# Altium schematic sheet Main.SchDoc
size A0 portrait; SheetNumber: 2; SheetTotal: 16
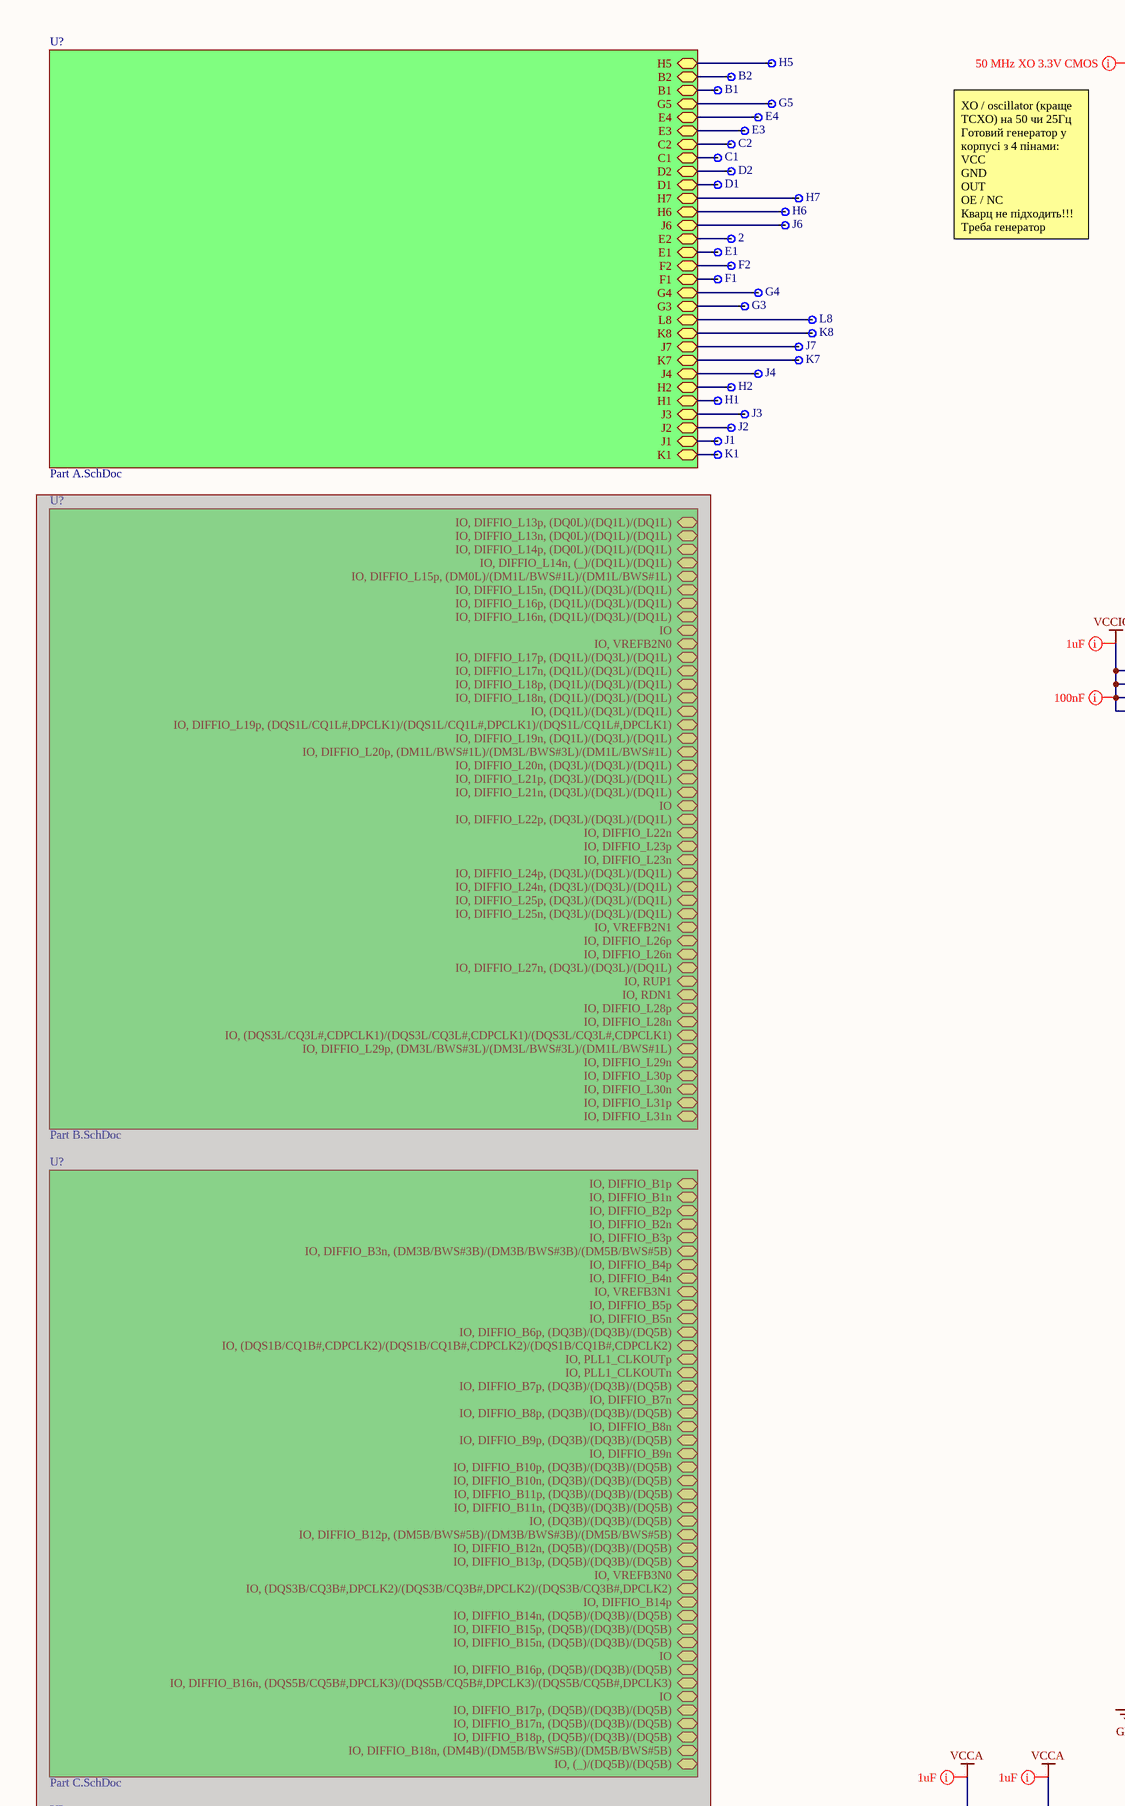
[diagram p0: Main.SchDoc, top left]
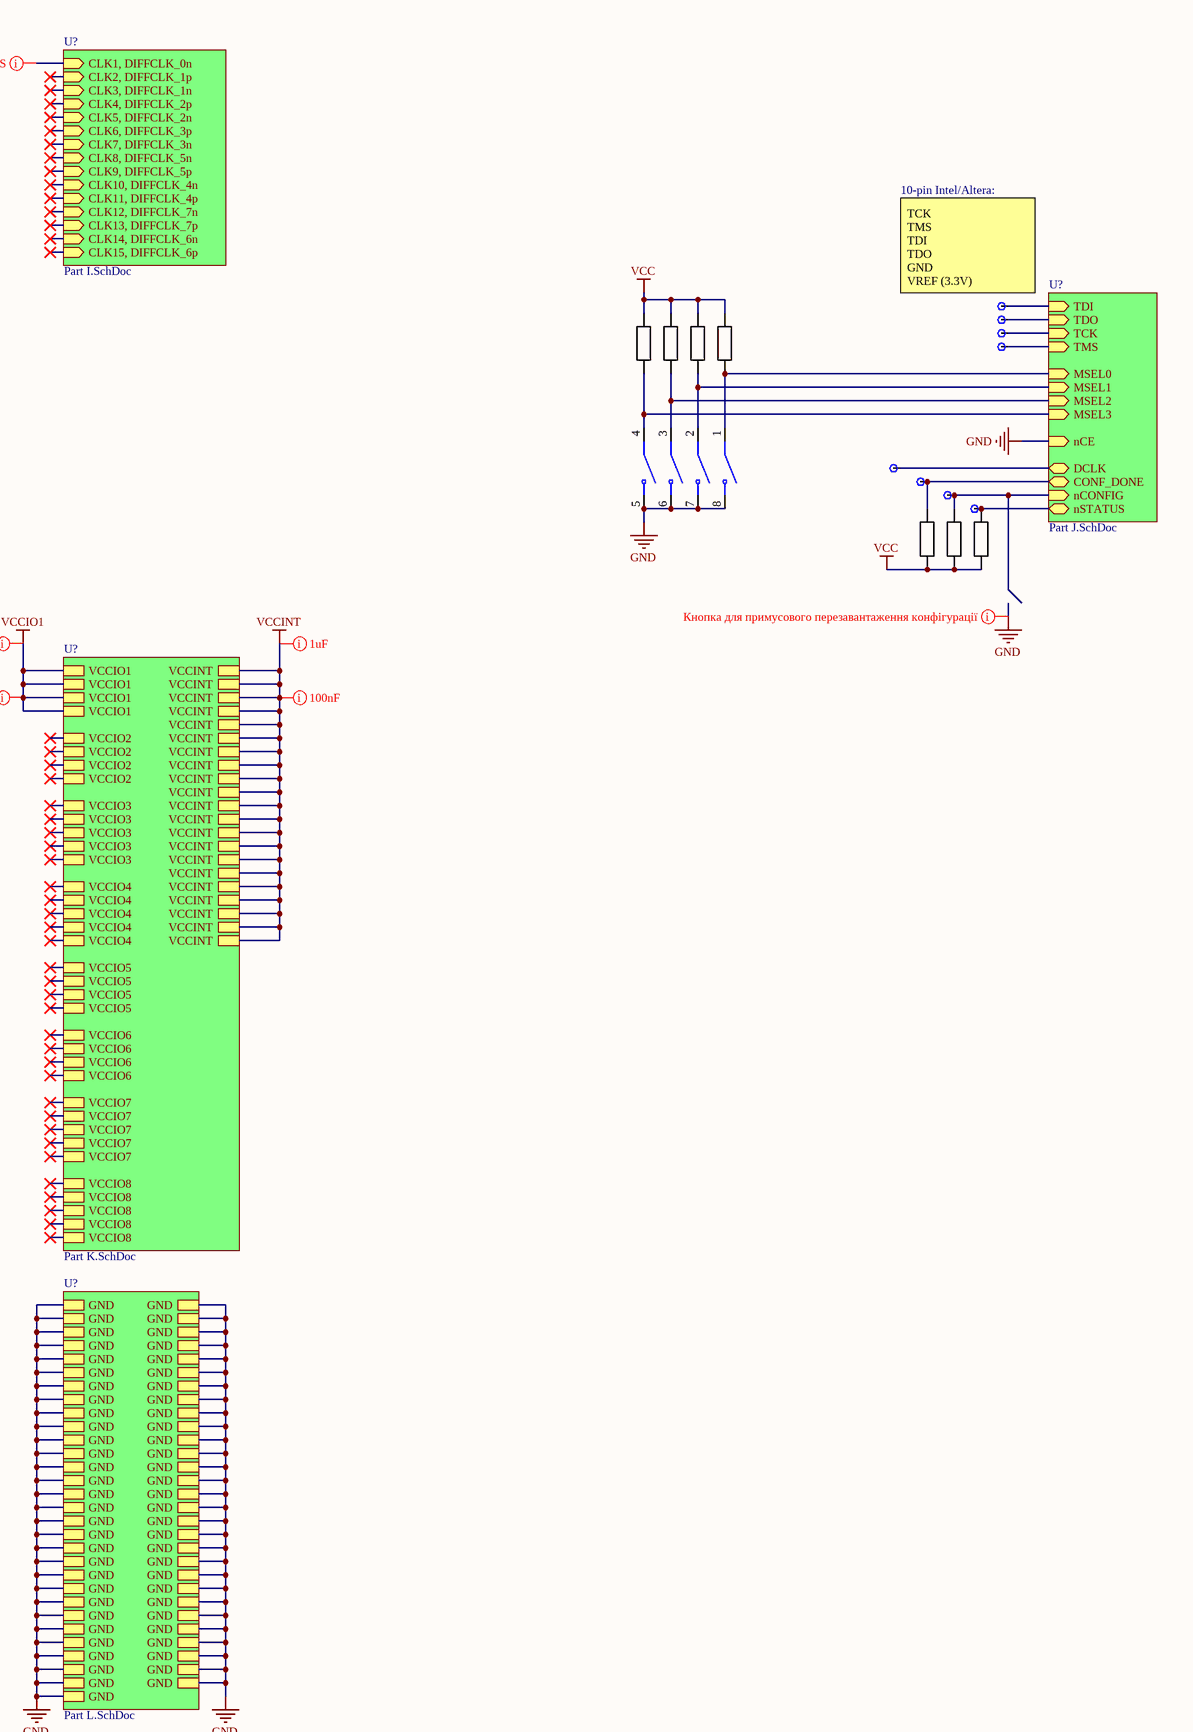
[diagram p1: Main.SchDoc, top right]
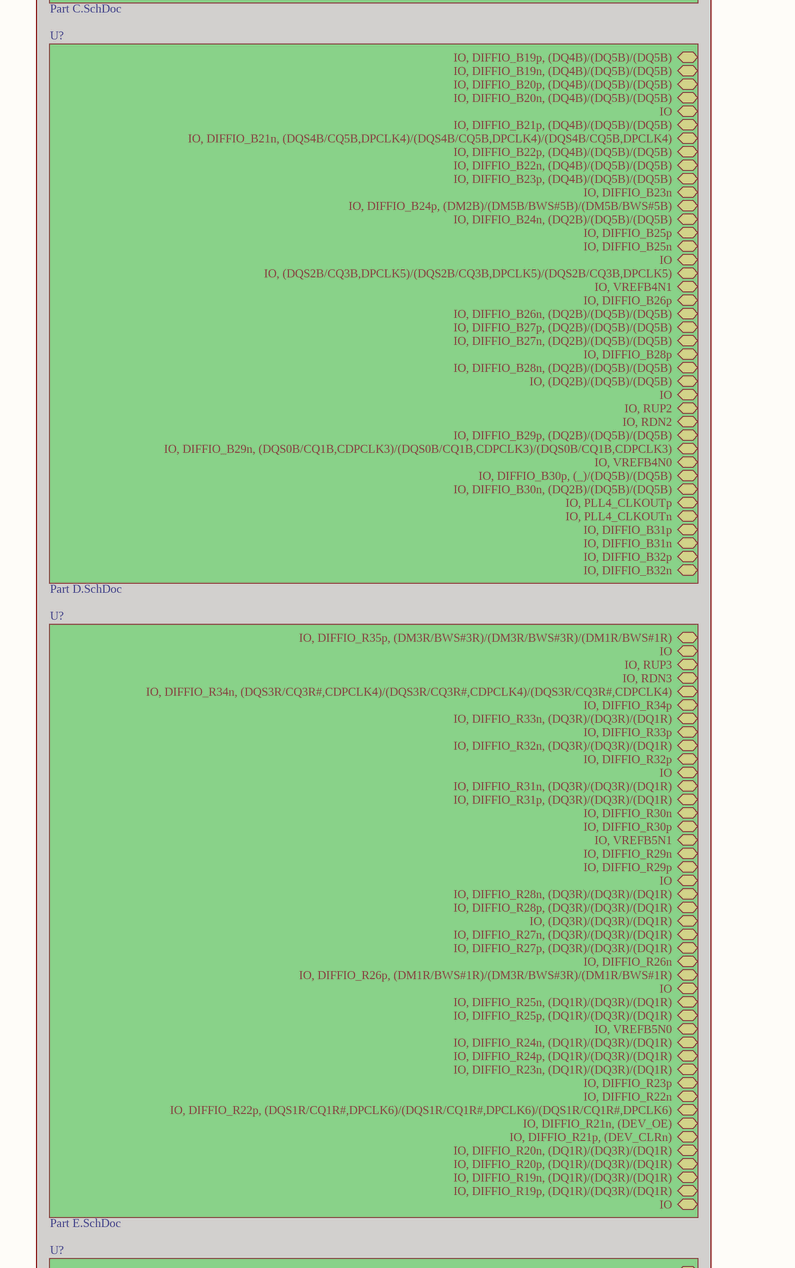
[diagram p2: Main.SchDoc, centre left]
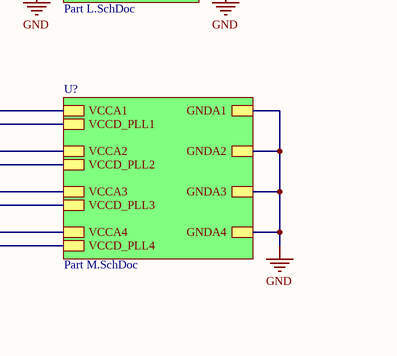
[diagram p3: Main.SchDoc, centre right]
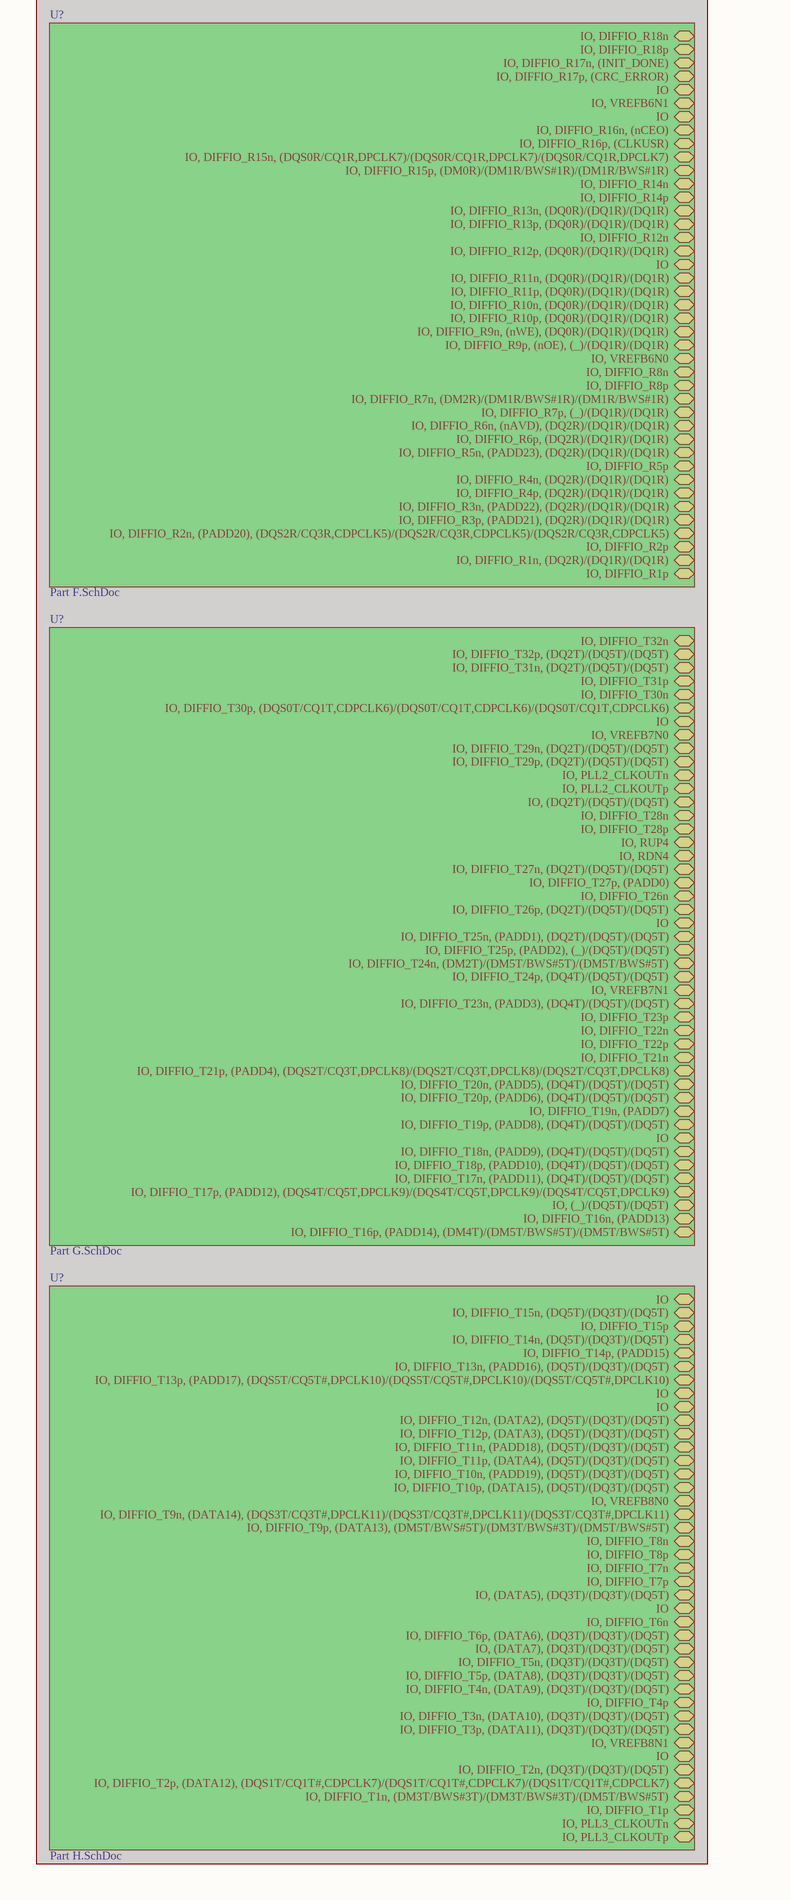
[diagram p4: Main.SchDoc, bottom left]

## Parts
J161  H5  [Pin1]
J162  B2  [Pin1]
J163  B1  [Pin1]
J164  G5  [Pin1]
J165  E4  [Pin1]
J166  E3  [Pin1]
J167  C2  [Pin1]
J168  C1  [Pin1]
J169  D2  [Pin1]
J170  D1  [Pin1]
J171  H7  [Pin1]
J172  H6  [Pin1]
J173  J6  [Pin1]
J174  2  [Pin1]
J175  E1  [Pin1]
J176  F2  [Pin1]
J177  F1  [Pin1]
J178  G4  [Pin1]
J179  G3  [Pin1]
J180  Pin1  [Pin1]  (value not drawn)
J181  L8  [Pin1]
J182  Pin1  [Pin1]  (value not drawn)
J183  K8  [Pin1]
J184  Pin1  [Pin1]  (value not drawn)
J185  J7  [Pin1]
J186  Pin1  [Pin1]  (value not drawn)
J187  K7  [Pin1]
J188  J4  [Pin1]
J189  H2  [Pin1]
J190  H1  [Pin1]
J191  J3  [Pin1]
J192  J2  [Pin1]
J193  J1  [Pin1]
J194  K1  [Pin1]
J195  Pin1  [Pin1]  (value not drawn)
J196  Pin1  [Pin1]  (value not drawn)
J197  Pin1  [Pin1]  (value not drawn)
J198  Pin1  [Pin1]  (value not drawn)
R1  10kOm 0603  [RES 0603]  (value not drawn)
R2  10kOm 0603  [RES 0603]  (value not drawn)
R3  10kOm 0603  [RES 0603]  (value not drawn)
R4  10kOm 0603  [RES 0603]  (value not drawn)
R5  10kOm 0603  [RES 0603]  (value not drawn)
R6  10kOm 0603  [RES 0603]  (value not drawn)
R7  10kOm 0603  [RES 0603]  (value not drawn)
S1  206-4  [SW_206-4]  (value not drawn)

## Sub-sheets
U? = Part A.SchDoc: H5 (bidir), B2 (bidir), B1 (bidir), G5 (bidir), E4 (bidir), E3 (bidir), C2 (bidir), C1 (bidir), D2 (bidir), D1 (bidir), H7 (bidir), H6 (bidir), J6 (bidir), E2 (bidir), E1 (bidir), F2 (bidir), F1 (bidir), G4 (bidir), G3 (bidir), L8 (bidir), K8 (bidir), J7 (bidir), K7 (bidir), J4 (bidir), H2 (bidir), H1 (bidir), J3 (bidir), J2 (bidir), J1 (bidir), K1 (bidir)
U? = Part B.SchDoc (masked out): IO, DIFFIO_L13p, (DQ0L)/(DQ1L)/(DQ1L) (bidir), IO, DIFFIO_L13n, (DQ0L)/(DQ1L)/(DQ1L) (bidir), IO, DIFFIO_L14p, (DQ0L)/(DQ1L)/(DQ1L) (bidir), IO, DIFFIO_L14n, (_)/(DQ1L)/(DQ1L) (bidir), IO, DIFFIO_L15p, (DM0L)/(DM1L/BWS#1L)/(DM1L/BWS#1L) (bidir), IO, DIFFIO_L15n, (DQ1L)/(DQ3L)/(DQ1L) (bidir), IO, DIFFIO_L16p, (DQ1L)/(DQ3L)/(DQ1L) (bidir), IO, DIFFIO_L16n, (DQ1L)/(DQ3L)/(DQ1L) (bidir), IO (bidir), IO, VREFB2N0 (bidir), IO, DIFFIO_L17p, (DQ1L)/(DQ3L)/(DQ1L) (bidir), IO, DIFFIO_L17n, (DQ1L)/(DQ3L)/(DQ1L) (bidir), IO, DIFFIO_L18p, (DQ1L)/(DQ3L)/(DQ1L) (bidir), IO, DIFFIO_L18n, (DQ1L)/(DQ3L)/(DQ1L) (bidir), IO, (DQ1L)/(DQ3L)/(DQ1L) (bidir), IO, DIFFIO_L19p, (DQS1L/CQ1L#,DPCLK1)/(DQS1L/CQ1L#,DPCLK1)/(DQS1L/CQ1L#,DPCLK1) (bidir), IO, DIFFIO_L19n, (DQ1L)/(DQ3L)/(DQ1L) (bidir), IO, DIFFIO_L20p, (DM1L/BWS#1L)/(DM3L/BWS#3L)/(DM1L/BWS#1L) (bidir), IO, DIFFIO_L20n, (DQ3L)/(DQ3L)/(DQ1L) (bidir), IO, DIFFIO_L21p, (DQ3L)/(DQ3L)/(DQ1L) (bidir), IO, DIFFIO_L21n, (DQ3L)/(DQ3L)/(DQ1L) (bidir), IO (bidir), IO, DIFFIO_L22p, (DQ3L)/(DQ3L)/(DQ1L) (bidir), IO, DIFFIO_L22n (bidir), IO, DIFFIO_L23p (bidir), IO, DIFFIO_L23n (bidir), IO, DIFFIO_L24p, (DQ3L)/(DQ3L)/(DQ1L) (bidir), IO, DIFFIO_L24n, (DQ3L)/(DQ3L)/(DQ1L) (bidir), IO, DIFFIO_L25p, (DQ3L)/(DQ3L)/(DQ1L) (bidir), IO, DIFFIO_L25n, (DQ3L)/(DQ3L)/(DQ1L) (bidir), IO, VREFB2N1 (bidir), IO, DIFFIO_L26p (bidir), IO, DIFFIO_L26n (bidir), IO, DIFFIO_L27n, (DQ3L)/(DQ3L)/(DQ1L) (bidir), IO, RUP1 (bidir), IO, RDN1 (bidir), IO, DIFFIO_L28p (bidir), IO, DIFFIO_L28n (bidir), IO, (DQS3L/CQ3L#,CDPCLK1)/(DQS3L/CQ3L#,CDPCLK1)/(DQS3L/CQ3L#,CDPCLK1) (bidir), IO, DIFFIO_L29p, (DM3L/BWS#3L)/(DM3L/BWS#3L)/(DM1L/BWS#1L) (bidir), IO, DIFFIO_L29n (bidir), IO, DIFFIO_L30p (bidir), IO, DIFFIO_L30n (bidir), IO, DIFFIO_L31p (bidir), IO, DIFFIO_L31n (bidir)
U? = Part C.SchDoc (masked out): IO, DIFFIO_B1p (bidir), IO, DIFFIO_B1n (bidir), IO, DIFFIO_B2p (bidir), IO, DIFFIO_B2n (bidir), IO, DIFFIO_B3p (bidir), IO, DIFFIO_B3n, (DM3B/BWS#3B)/(DM3B/BWS#3B)/(DM5B/BWS#5B) (bidir), IO, DIFFIO_B4p (bidir), IO, DIFFIO_B4n (bidir), IO, VREFB3N1 (bidir), IO, DIFFIO_B5p (bidir), IO, DIFFIO_B5n (bidir), IO, DIFFIO_B6p, (DQ3B)/(DQ3B)/(DQ5B) (bidir), IO, (DQS1B/CQ1B#,CDPCLK2)/(DQS1B/CQ1B#,CDPCLK2)/(DQS1B/CQ1B#,CDPCLK2) (bidir), IO, PLL1_CLKOUTp (bidir), IO, PLL1_CLKOUTn (bidir), IO, DIFFIO_B7p, (DQ3B)/(DQ3B)/(DQ5B) (bidir), IO, DIFFIO_B7n (bidir), IO, DIFFIO_B8p, (DQ3B)/(DQ3B)/(DQ5B) (bidir), IO, DIFFIO_B8n (bidir), IO, DIFFIO_B9p, (DQ3B)/(DQ3B)/(DQ5B) (bidir), IO, DIFFIO_B9n (bidir), IO, DIFFIO_B10p, (DQ3B)/(DQ3B)/(DQ5B) (bidir), IO, DIFFIO_B10n, (DQ3B)/(DQ3B)/(DQ5B) (bidir), IO, DIFFIO_B11p, (DQ3B)/(DQ3B)/(DQ5B) (bidir), IO, DIFFIO_B11n, (DQ3B)/(DQ3B)/(DQ5B) (bidir), IO, (DQ3B)/(DQ3B)/(DQ5B) (bidir), IO, DIFFIO_B12p, (DM5B/BWS#5B)/(DM3B/BWS#3B)/(DM5B/BWS#5B) (bidir), IO, DIFFIO_B12n, (DQ5B)/(DQ3B)/(DQ5B) (bidir), IO, DIFFIO_B13p, (DQ5B)/(DQ3B)/(DQ5B) (bidir), IO, VREFB3N0 (bidir), IO, (DQS3B/CQ3B#,DPCLK2)/(DQS3B/CQ3B#,DPCLK2)/(DQS3B/CQ3B#,DPCLK2) (bidir), IO, DIFFIO_B14p (bidir), IO, DIFFIO_B14n, (DQ5B)/(DQ3B)/(DQ5B) (bidir), IO, DIFFIO_B15p, (DQ5B)/(DQ3B)/(DQ5B) (bidir), IO, DIFFIO_B15n, (DQ5B)/(DQ3B)/(DQ5B) (bidir), IO (bidir), IO, DIFFIO_B16p, (DQ5B)/(DQ3B)/(DQ5B) (bidir), IO, DIFFIO_B16n, (DQS5B/CQ5B#,DPCLK3)/(DQS5B/CQ5B#,DPCLK3)/(DQS5B/CQ5B#,DPCLK3) (bidir), IO (bidir), IO, DIFFIO_B17p, (DQ5B)/(DQ3B)/(DQ5B) (bidir), IO, DIFFIO_B17n, (DQ5B)/(DQ3B)/(DQ5B) (bidir), IO, DIFFIO_B18p, (DQ5B)/(DQ3B)/(DQ5B) (bidir), IO, DIFFIO_B18n, (DM4B)/(DM5B/BWS#5B)/(DM5B/BWS#5B) (bidir), IO, (_)/(DQ5B)/(DQ5B) (bidir)
U? = Part D.SchDoc (masked out): IO, DIFFIO_B19p, (DQ4B)/(DQ5B)/(DQ5B) (bidir), IO, DIFFIO_B19n, (DQ4B)/(DQ5B)/(DQ5B) (bidir), IO, DIFFIO_B20p, (DQ4B)/(DQ5B)/(DQ5B) (bidir), IO, DIFFIO_B20n, (DQ4B)/(DQ5B)/(DQ5B) (bidir), IO (bidir), IO, DIFFIO_B21p, (DQ4B)/(DQ5B)/(DQ5B) (bidir), IO, DIFFIO_B21n, (DQS4B/CQ5B,DPCLK4)/(DQS4B/CQ5B,DPCLK4)/(DQS4B/CQ5B,DPCLK4) (bidir), IO, DIFFIO_B22p, (DQ4B)/(DQ5B)/(DQ5B) (bidir), IO, DIFFIO_B22n, (DQ4B)/(DQ5B)/(DQ5B) (bidir), IO, DIFFIO_B23p, (DQ4B)/(DQ5B)/(DQ5B) (bidir), IO, DIFFIO_B23n (bidir), IO, DIFFIO_B24p, (DM2B)/(DM5B/BWS#5B)/(DM5B/BWS#5B) (bidir), IO, DIFFIO_B24n, (DQ2B)/(DQ5B)/(DQ5B) (bidir), IO, DIFFIO_B25p (bidir), IO, DIFFIO_B25n (bidir), IO (bidir), IO, (DQS2B/CQ3B,DPCLK5)/(DQS2B/CQ3B,DPCLK5)/(DQS2B/CQ3B,DPCLK5) (bidir), IO, VREFB4N1 (bidir), IO, DIFFIO_B26p (bidir), IO, DIFFIO_B26n, (DQ2B)/(DQ5B)/(DQ5B) (bidir), IO, DIFFIO_B27p, (DQ2B)/(DQ5B)/(DQ5B) (bidir), IO, DIFFIO_B27n, (DQ2B)/(DQ5B)/(DQ5B) (bidir), IO, DIFFIO_B28p (bidir), IO, DIFFIO_B28n, (DQ2B)/(DQ5B)/(DQ5B) (bidir), IO, (DQ2B)/(DQ5B)/(DQ5B) (bidir), IO (bidir), IO, RUP2 (bidir), IO, RDN2 (bidir), IO, DIFFIO_B29p, (DQ2B)/(DQ5B)/(DQ5B) (bidir), IO, DIFFIO_B29n, (DQS0B/CQ1B,CDPCLK3)/(DQS0B/CQ1B,CDPCLK3)/(DQS0B/CQ1B,CDPCLK3) (bidir), IO, VREFB4N0 (bidir), IO, DIFFIO_B30p, (_)/(DQ5B)/(DQ5B) (bidir), IO, DIFFIO_B30n, (DQ2B)/(DQ5B)/(DQ5B) (bidir), IO, PLL4_CLKOUTp (bidir), IO, PLL4_CLKOUTn (bidir), IO, DIFFIO_B31p (bidir), IO, DIFFIO_B31n (bidir), IO, DIFFIO_B32p (bidir), IO, DIFFIO_B32n (bidir)
U? = Part E.SchDoc (masked out): IO, DIFFIO_R35p, (DM3R/BWS#3R)/(DM3R/BWS#3R)/(DM1R/BWS#1R) (bidir), IO (bidir), IO, RUP3 (bidir), IO, RDN3 (bidir), IO, DIFFIO_R34n, (DQS3R/CQ3R#,CDPCLK4)/(DQS3R/CQ3R#,CDPCLK4)/(DQS3R/CQ3R#,CDPCLK4) (bidir), IO, DIFFIO_R34p (bidir), IO, DIFFIO_R33n, (DQ3R)/(DQ3R)/(DQ1R) (bidir), IO, DIFFIO_R33p (bidir), IO, DIFFIO_R32n, (DQ3R)/(DQ3R)/(DQ1R) (bidir), IO, DIFFIO_R32p (bidir), IO (bidir), IO, DIFFIO_R31n, (DQ3R)/(DQ3R)/(DQ1R) (bidir), IO, DIFFIO_R31p, (DQ3R)/(DQ3R)/(DQ1R) (bidir), IO, DIFFIO_R30n (bidir), IO, DIFFIO_R30p (bidir), IO, VREFB5N1 (bidir), IO, DIFFIO_R29n (bidir), IO, DIFFIO_R29p (bidir), IO (bidir), IO, DIFFIO_R28n, (DQ3R)/(DQ3R)/(DQ1R) (bidir), IO, DIFFIO_R28p, (DQ3R)/(DQ3R)/(DQ1R) (bidir), IO, (DQ3R)/(DQ3R)/(DQ1R) (bidir), IO, DIFFIO_R27n, (DQ3R)/(DQ3R)/(DQ1R) (bidir), IO, DIFFIO_R27p, (DQ3R)/(DQ3R)/(DQ1R) (bidir), IO, DIFFIO_R26n (bidir), IO, DIFFIO_R26p, (DM1R/BWS#1R)/(DM3R/BWS#3R)/(DM1R/BWS#1R) (bidir), IO (bidir), IO, DIFFIO_R25n, (DQ1R)/(DQ3R)/(DQ1R) (bidir), IO, DIFFIO_R25p, (DQ1R)/(DQ3R)/(DQ1R) (bidir), IO, VREFB5N0 (bidir), IO, DIFFIO_R24n, (DQ1R)/(DQ3R)/(DQ1R) (bidir), IO, DIFFIO_R24p, (DQ1R)/(DQ3R)/(DQ1R) (bidir), IO, DIFFIO_R23n, (DQ1R)/(DQ3R)/(DQ1R) (bidir), IO, DIFFIO_R23p (bidir), IO, DIFFIO_R22n (bidir), IO, DIFFIO_R22p, (DQS1R/CQ1R#,DPCLK6)/(DQS1R/CQ1R#,DPCLK6)/(DQS1R/CQ1R#,DPCLK6) (bidir), IO, DIFFIO_R21n, (DEV_OE) (bidir), IO, DIFFIO_R21p, (DEV_CLRn) (bidir), IO, DIFFIO_R20n, (DQ1R)/(DQ3R)/(DQ1R) (bidir), IO, DIFFIO_R20p, (DQ1R)/(DQ3R)/(DQ1R) (bidir), IO, DIFFIO_R19n, (DQ1R)/(DQ3R)/(DQ1R) (bidir), IO, DIFFIO_R19p, (DQ1R)/(DQ3R)/(DQ1R) (bidir), IO (bidir)
U? = Part F.SchDoc (masked out): IO, DIFFIO_R18n (bidir), IO, DIFFIO_R18p (bidir), IO, DIFFIO_R17n, (INIT_DONE) (bidir), IO, DIFFIO_R17p, (CRC_ERROR) (bidir), IO (bidir), IO, VREFB6N1 (bidir), IO (bidir), IO, DIFFIO_R16n, (nCEO) (bidir), IO, DIFFIO_R16p, (CLKUSR) (bidir), IO, DIFFIO_R15n, (DQS0R/CQ1R,DPCLK7)/(DQS0R/CQ1R,DPCLK7)/(DQS0R/CQ1R,DPCLK7) (bidir), IO, DIFFIO_R15p, (DM0R)/(DM1R/BWS#1R)/(DM1R/BWS#1R) (bidir), IO, DIFFIO_R14n (bidir), IO, DIFFIO_R14p (bidir), IO, DIFFIO_R13n, (DQ0R)/(DQ1R)/(DQ1R) (bidir), IO, DIFFIO_R13p, (DQ0R)/(DQ1R)/(DQ1R) (bidir), IO, DIFFIO_R12n (bidir), IO, DIFFIO_R12p, (DQ0R)/(DQ1R)/(DQ1R) (bidir), IO (bidir), IO, DIFFIO_R11n, (DQ0R)/(DQ1R)/(DQ1R) (bidir), IO, DIFFIO_R11p, (DQ0R)/(DQ1R)/(DQ1R) (bidir), IO, DIFFIO_R10n, (DQ0R)/(DQ1R)/(DQ1R) (bidir), IO, DIFFIO_R10p, (DQ0R)/(DQ1R)/(DQ1R) (bidir), IO, DIFFIO_R9n, (nWE), (DQ0R)/(DQ1R)/(DQ1R) (bidir), IO, DIFFIO_R9p, (nOE), (_)/(DQ1R)/(DQ1R) (bidir), IO, VREFB6N0 (bidir), IO, DIFFIO_R8n (bidir), IO, DIFFIO_R8p (bidir), IO, DIFFIO_R7n, (DM2R)/(DM1R/BWS#1R)/(DM1R/BWS#1R) (bidir), IO, DIFFIO_R7p, (_)/(DQ1R)/(DQ1R) (bidir), IO, DIFFIO_R6n, (nAVD), (DQ2R)/(DQ1R)/(DQ1R) (bidir), IO, DIFFIO_R6p, (DQ2R)/(DQ1R)/(DQ1R) (bidir), IO, DIFFIO_R5n, (PADD23), (DQ2R)/(DQ1R)/(DQ1R) (bidir), IO, DIFFIO_R5p (bidir), IO, DIFFIO_R4n, (DQ2R)/(DQ1R)/(DQ1R) (bidir), IO, DIFFIO_R4p, (DQ2R)/(DQ1R)/(DQ1R) (bidir), IO, DIFFIO_R3n, (PADD22), (DQ2R)/(DQ1R)/(DQ1R) (bidir), IO, DIFFIO_R3p, (PADD21), (DQ2R)/(DQ1R)/(DQ1R) (bidir), IO, DIFFIO_R2n, (PADD20), (DQS2R/CQ3R,CDPCLK5)/(DQS2R/CQ3R,CDPCLK5)/(DQS2R/CQ3R,CDPCLK5) (bidir), IO, DIFFIO_R2p (bidir), IO, DIFFIO_R1n, (DQ2R)/(DQ1R)/(DQ1R) (bidir), IO, DIFFIO_R1p (bidir)
U? = Part G.SchDoc (masked out): IO, DIFFIO_T32n (bidir), IO, DIFFIO_T32p, (DQ2T)/(DQ5T)/(DQ5T) (bidir), IO, DIFFIO_T31n, (DQ2T)/(DQ5T)/(DQ5T) (bidir), IO, DIFFIO_T31p (bidir), IO, DIFFIO_T30n (bidir), IO, DIFFIO_T30p, (DQS0T/CQ1T,CDPCLK6)/(DQS0T/CQ1T,CDPCLK6)/(DQS0T/CQ1T,CDPCLK6) (bidir), IO (bidir), IO, VREFB7N0 (bidir), IO, DIFFIO_T29n, (DQ2T)/(DQ5T)/(DQ5T) (bidir), IO, DIFFIO_T29p, (DQ2T)/(DQ5T)/(DQ5T) (bidir), IO, PLL2_CLKOUTn (bidir), IO, PLL2_CLKOUTp (bidir), IO, (DQ2T)/(DQ5T)/(DQ5T) (bidir), IO, DIFFIO_T28n (bidir), IO, DIFFIO_T28p (bidir), IO, RUP4 (bidir), IO, RDN4 (bidir), IO, DIFFIO_T27n, (DQ2T)/(DQ5T)/(DQ5T) (bidir), IO, DIFFIO_T27p, (PADD0) (bidir), IO, DIFFIO_T26n (bidir), IO, DIFFIO_T26p, (DQ2T)/(DQ5T)/(DQ5T) (bidir), IO (bidir), IO, DIFFIO_T25n, (PADD1), (DQ2T)/(DQ5T)/(DQ5T) (bidir), IO, DIFFIO_T25p, (PADD2), (_)/(DQ5T)/(DQ5T) (bidir), IO, DIFFIO_T24n, (DM2T)/(DM5T/BWS#5T)/(DM5T/BWS#5T) (bidir), IO, DIFFIO_T24p, (DQ4T)/(DQ5T)/(DQ5T) (bidir), IO, VREFB7N1 (bidir), IO, DIFFIO_T23n, (PADD3), (DQ4T)/(DQ5T)/(DQ5T) (bidir), IO, DIFFIO_T23p (bidir), IO, DIFFIO_T22n (bidir), IO, DIFFIO_T22p (bidir), IO, DIFFIO_T21n (bidir), IO, DIFFIO_T21p, (PADD4), (DQS2T/CQ3T,DPCLK8)/(DQS2T/CQ3T,DPCLK8)/(DQS2T/CQ3T,DPCLK8) (bidir), IO, DIFFIO_T20n, (PADD5), (DQ4T)/(DQ5T)/(DQ5T) (bidir), IO, DIFFIO_T20p, (PADD6), (DQ4T)/(DQ5T)/(DQ5T) (bidir), IO, DIFFIO_T19n, (PADD7) (bidir), IO, DIFFIO_T19p, (PADD8), (DQ4T)/(DQ5T)/(DQ5T) (bidir), IO (bidir), IO, DIFFIO_T18n, (PADD9), (DQ4T)/(DQ5T)/(DQ5T) (bidir), IO, DIFFIO_T18p, (PADD10), (DQ4T)/(DQ5T)/(DQ5T) (bidir), IO, DIFFIO_T17n, (PADD11), (DQ4T)/(DQ5T)/(DQ5T) (bidir), IO, DIFFIO_T17p, (PADD12), (DQS4T/CQ5T,DPCLK9)/(DQS4T/CQ5T,DPCLK9)/(DQS4T/CQ5T,DPCLK9) (bidir), IO, (_)/(DQ5T)/(DQ5T) (bidir), IO, DIFFIO_T16n, (PADD13) (bidir), IO, DIFFIO_T16p, (PADD14), (DM4T)/(DM5T/BWS#5T)/(DM5T/BWS#5T) (bidir)
U? = Part H.SchDoc (masked out): IO (bidir), IO, DIFFIO_T15n, (DQ5T)/(DQ3T)/(DQ5T) (bidir), IO, DIFFIO_T15p (bidir), IO, DIFFIO_T14n, (DQ5T)/(DQ3T)/(DQ5T) (bidir), IO, DIFFIO_T14p, (PADD15) (bidir), IO, DIFFIO_T13n, (PADD16), (DQ5T)/(DQ3T)/(DQ5T) (bidir), IO, DIFFIO_T13p, (PADD17), (DQS5T/CQ5T#,DPCLK10)/(DQS5T/CQ5T#,DPCLK10)/(DQS5T/CQ5T#,DPCLK10) (bidir), IO (bidir), IO (bidir), IO, DIFFIO_T12n, (DATA2), (DQ5T)/(DQ3T)/(DQ5T) (bidir), IO, DIFFIO_T12p, (DATA3), (DQ5T)/(DQ3T)/(DQ5T) (bidir), IO, DIFFIO_T11n, (PADD18), (DQ5T)/(DQ3T)/(DQ5T) (bidir), IO, DIFFIO_T11p, (DATA4), (DQ5T)/(DQ3T)/(DQ5T) (bidir), IO, DIFFIO_T10n, (PADD19), (DQ5T)/(DQ3T)/(DQ5T) (bidir), IO, DIFFIO_T10p, (DATA15), (DQ5T)/(DQ3T)/(DQ5T) (bidir), IO, VREFB8N0 (bidir), IO, DIFFIO_T9n, (DATA14), (DQS3T/CQ3T#,DPCLK11)/(DQS3T/CQ3T#,DPCLK11)/(DQS3T/CQ3T#,DPCLK11) (bidir), IO, DIFFIO_T9p, (DATA13), (DM5T/BWS#5T)/(DM3T/BWS#3T)/(DM5T/BWS#5T) (bidir), IO, DIFFIO_T8n (bidir), IO, DIFFIO_T8p (bidir), IO, DIFFIO_T7n (bidir), IO, DIFFIO_T7p (bidir), IO, (DATA5), (DQ3T)/(DQ3T)/(DQ5T) (bidir), IO (bidir), IO, DIFFIO_T6n (bidir), IO, DIFFIO_T6p, (DATA6), (DQ3T)/(DQ3T)/(DQ5T) (bidir), IO, (DATA7), (DQ3T)/(DQ3T)/(DQ5T) (bidir), IO, DIFFIO_T5n, (DQ3T)/(DQ3T)/(DQ5T) (bidir), IO, DIFFIO_T5p, (DATA8), (DQ3T)/(DQ3T)/(DQ5T) (bidir), IO, DIFFIO_T4n, (DATA9), (DQ3T)/(DQ3T)/(DQ5T) (bidir), IO, DIFFIO_T4p (bidir), IO, DIFFIO_T3n, (DATA10), (DQ3T)/(DQ3T)/(DQ5T) (bidir), IO, DIFFIO_T3p, (DATA11), (DQ3T)/(DQ3T)/(DQ5T) (bidir), IO, VREFB8N1 (bidir), IO (bidir), IO, DIFFIO_T2n, (DQ3T)/(DQ3T)/(DQ5T) (bidir), IO, DIFFIO_T2p, (DATA12), (DQS1T/CQ1T#,CDPCLK7)/(DQS1T/CQ1T#,CDPCLK7)/(DQS1T/CQ1T#,CDPCLK7) (bidir), IO, DIFFIO_T1n, (DM3T/BWS#3T)/(DM3T/BWS#3T)/(DM5T/BWS#5T) (bidir), IO, DIFFIO_T1p (bidir), IO, PLL3_CLKOUTn (bidir), IO, PLL3_CLKOUTp (bidir)
U? = Part I.SchDoc: CLK1, DIFFCLK_0n (in), CLK2, DIFFCLK_1p (in), CLK3, DIFFCLK_1n (in), CLK4, DIFFCLK_2p (in), CLK5, DIFFCLK_2n (in), CLK6, DIFFCLK_3p (in), CLK7, DIFFCLK_3n (in), CLK8, DIFFCLK_5n (in), CLK9, DIFFCLK_5p (in), CLK10, DIFFCLK_4n (in), CLK11, DIFFCLK_4p (in), CLK12, DIFFCLK_7n (in), CLK13, DIFFCLK_7p (in), CLK14, DIFFCLK_6n (in), CLK15, DIFFCLK_6p (in)
U? = Part J.SchDoc: TDI (in), TDO (in), TCK (in), TMS (in), MSEL0 (in), MSEL1 (in), MSEL2 (in), MSEL3 (in), nCE (in), DCLK (bidir), CONF_DONE (bidir), nCONFIG (in), nSTATUS (bidir)
U? = Part K.SchDoc: VCCINT, VCCINT, VCCINT, VCCINT, VCCINT, VCCINT, VCCINT, VCCINT, VCCINT, VCCINT, VCCINT, VCCINT, VCCINT, VCCINT, VCCINT, VCCINT, VCCINT, VCCINT, VCCINT, VCCINT, VCCINT, VCCIO1, VCCIO1, VCCIO1, VCCIO1, VCCIO2, VCCIO2, VCCIO2, VCCIO2, VCCIO3, VCCIO3, VCCIO3, VCCIO3, VCCIO3, VCCIO4, VCCIO4, VCCIO4, VCCIO4, VCCIO4, VCCIO5, VCCIO5, VCCIO5, VCCIO5, VCCIO6, VCCIO6, VCCIO6, VCCIO6, VCCIO7, VCCIO7, VCCIO7, VCCIO7, VCCIO7, VCCIO8, VCCIO8, VCCIO8, VCCIO8, VCCIO8
U? = Part L.SchDoc: GND, GND, GND, GND, GND, GND, GND, GND, GND, GND, GND, GND, GND, GND, GND, GND, GND, GND, GND, GND, GND, GND, GND, GND, GND, GND, GND, GND, GND, GND, GND, GND, GND, GND, GND, GND, GND, GND, GND, GND, GND, GND, GND, GND, GND, GND, GND, GND, GND, GND, GND, GND, GND, GND, GND, GND, GND, GND, GND
U? = Part M.SchDoc: GNDA1, GNDA2, GNDA3, GNDA4, VCCA1, VCCA2, VCCA3, VCCA4, VCCD_PLL1, VCCD_PLL2, VCCD_PLL3, VCCD_PLL4

## Nets
GND: S1.5(NO4) S1.6(NO3) S1.7(NO2) S1.8(NO1) ; sheet U?/nCE, sheet U?/GND, sheet U?/GND, sheet U?/GND, sheet U?/GND, sheet U?/GND, sheet U?/GND, sheet U?/GND, sheet U?/GND, sheet U?/GND, sheet U?/GND, sheet U?/GND, sheet U?/GND, sheet U?/GND, sheet U?/GND, sheet U?/GND, sheet U?/GND, sheet U?/GND, sheet U?/GND, sheet U?/GND, sheet U?/GND, sheet U?/GND, sheet U?/GND, sheet U?/GND, sheet U?/GND, sheet U?/GND, sheet U?/GND, sheet U?/GND, sheet U?/GND, sheet U?/GND, sheet U?/GND, sheet U?/GND, sheet U?/GND, sheet U?/GND, sheet U?/GND, sheet U?/GND, sheet U?/GND, sheet U?/GND, sheet U?/GND, sheet U?/GND, sheet U?/GND, sheet U?/GND, sheet U?/GND, sheet U?/GND, sheet U?/GND, sheet U?/GND, sheet U?/GND, sheet U?/GND, sheet U?/GND, sheet U?/GND, sheet U?/GND, sheet U?/GND, sheet U?/GND, sheet U?/GND, sheet U?/GND, sheet U?/GND, sheet U?/GND, sheet U?/GND, sheet U?/GND, sheet U?/GND, sheet U?/GNDA1, sheet U?/GNDA2, sheet U?/GNDA3, sheet U?/GNDA4
VCC: R1.2 R2.2 R3.2 R4.2 R5.1 R6.1 R7.1
VCCA: sheet U?/VCCA1, sheet U?/VCCA2, sheet U?/VCCA3, sheet U?/VCCA4, sheet U?/VCCD_PLL1, sheet U?/VCCD_PLL2, sheet U?/VCCD_PLL3, sheet U?/VCCD_PLL4
VCCINT: sheet U?/VCCINT, sheet U?/VCCINT, sheet U?/VCCINT, sheet U?/VCCINT, sheet U?/VCCINT, sheet U?/VCCINT, sheet U?/VCCINT, sheet U?/VCCINT, sheet U?/VCCINT, sheet U?/VCCINT, sheet U?/VCCINT, sheet U?/VCCINT, sheet U?/VCCINT, sheet U?/VCCINT, sheet U?/VCCINT, sheet U?/VCCINT, sheet U?/VCCINT, sheet U?/VCCINT, sheet U?/VCCINT, sheet U?/VCCINT, sheet U?/VCCINT
VCCIO1: sheet U?/VCCIO1, sheet U?/VCCIO1, sheet U?/VCCIO1, sheet U?/VCCIO1
NetJ161_1: J161.1 ; sheet U?/H5
NetJ162_1: J162.1 ; sheet U?/B2
NetJ163_1: J163.1 ; sheet U?/B1
NetJ164_1: J164.1 ; sheet U?/G5
NetJ165_1: J165.1 ; sheet U?/E4
NetJ166_1: J166.1 ; sheet U?/E3
NetJ167_1: J167.1 ; sheet U?/C2
NetJ168_1: J168.1 ; sheet U?/C1
NetJ169_1: J169.1 ; sheet U?/D2
NetJ170_1: J170.1 ; sheet U?/D1
NetJ171_1: J171.1 ; sheet U?/H7
NetJ172_1: J172.1 ; sheet U?/H6
NetJ173_1: J173.1 ; sheet U?/J6
NetJ174_1: J174.1 ; sheet U?/E2
NetJ175_1: J175.1 ; sheet U?/E1
NetJ176_1: J176.1 ; sheet U?/F2
NetJ177_1: J177.1 ; sheet U?/F1
NetJ178_1: J178.1 ; sheet U?/G4
NetJ179_1: J179.1 ; sheet U?/G3
NetJ180_1: J180.1 ; sheet U?/TDI
NetJ181_1: J181.1 ; sheet U?/L8
NetJ182_1: J182.1 ; sheet U?/TDO
NetJ183_1: J183.1 ; sheet U?/K8
NetJ184_1: J184.1 ; sheet U?/TCK
NetJ185_1: J185.1 ; sheet U?/J7
NetJ186_1: J186.1 ; sheet U?/TMS
NetJ187_1: J187.1 ; sheet U?/K7
NetJ188_1: J188.1 ; sheet U?/J4
NetJ189_1: J189.1 ; sheet U?/H2
NetJ190_1: J190.1 ; sheet U?/H1
NetJ191_1: J191.1 ; sheet U?/J3
NetJ192_1: J192.1 ; sheet U?/J2
NetJ193_1: J193.1 ; sheet U?/J1
NetJ194_1: J194.1 ; sheet U?/K1
NetJ195_1: J195.1 ; sheet U?/DCLK
NetJ196_1: J196.1 R5.2 ; sheet U?/CONF_DONE
NetJ197_1: J197.1 R6.2 ; sheet U?/nCONFIG
NetJ198_1: J198.1 R7.2 ; sheet U?/nSTATUS
NetR1_1: R1.1 S1.4(COM4) ; sheet U?/MSEL3
NetR2_1: R2.1 S1.3(COM3) ; sheet U?/MSEL2
NetR3_1: R3.1 S1.2(COM2) ; sheet U?/MSEL1
NetR4_1: R4.1 S1.1(COM1) ; sheet U?/MSEL0

## Layout directives
mark named 1uF: VCCA, VCCINT, VCCIO1
mark named 100nF: VCCA, VCCINT, VCCIO1
mark named Кнопка для примусового перезавантаження конфігурації: GND
mark named 50 MHz XO 3.3V CMOS: (no net found under the mark)

## Notes on the sheet
- 10-pin Intel/Altera:
- XO / oscillator (краще TCXO) на 50 чи 25Гц
  Готовий генератор у корпусі з 4 пінами:
  VCC
  GND
  OUT
  OE / NC
  Кварц не підходить!!! Треба генератор
- (near J180) TCK
  TMS
  TDI
  TDO
  GND
  VREF (3.3V)

## Library data of the parts
J161-J179 J181 J183 J185 J187-J194 = Pin1
S1 = 206-4: MF: {'manufacturer': u'CTS Components'}; Package: None; Price: None; Value: *; MP: 206-4; Availability: Unavailable